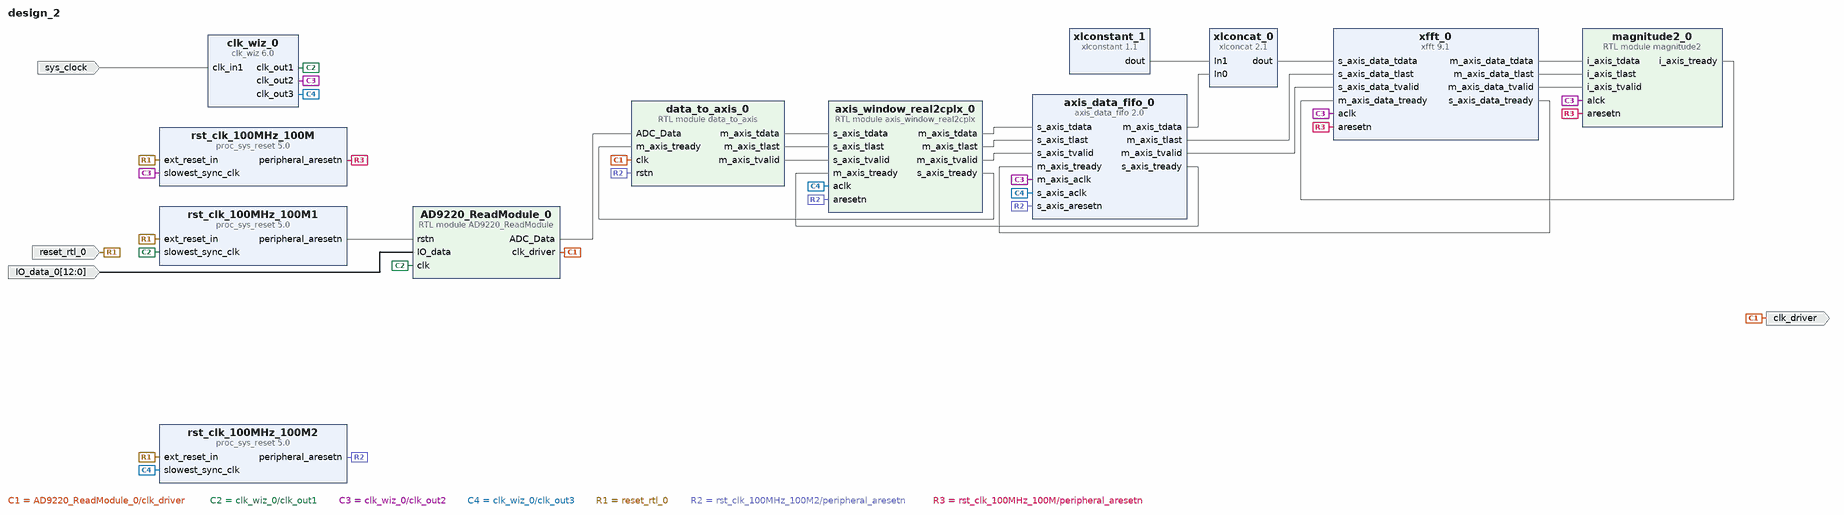
[diagram p0: block diagram of the top level]
# Vivado block design design_2, xc7z020clg400-1, Vivado 2025.2
create_bd_design design_2

create_bd_port -dir I -type rst reset_rtl_0
set_property -dict {CONFIG.POLARITY ACTIVE_HIGH} [get_bd_ports reset_rtl_0]
create_bd_port -dir I -from 12 -to 0 IO_data_0
create_bd_port -dir O -type clk clk_driver
set_property -dict {CONFIG.FREQ_HZ 65000000} [get_bd_ports clk_driver]
create_bd_port -dir I -type clk sys_clock
set_property -dict {CONFIG.FREQ_HZ 125000000} [get_bd_ports sys_clock]

create_bd_cell -type ip -vlnv xilinx.com:ip:proc_sys_reset:5.0 rst_clk_100MHz_100M
create_bd_cell -type module -reference AD9220_ReadModule AD9220_ReadModule_0
create_bd_cell -type module -reference data_to_axis data_to_axis_0
create_bd_cell -type module -reference axis_window_real2cplx axis_window_real2cplx_0
create_bd_cell -type ip -vlnv xilinx.com:ip:xfft:9.1 xfft_0
set_property -dict [list \
  CONFIG.aresetn true \
  CONFIG.input_width 16 \
  CONFIG.number_of_stages_using_block_ram_for_data_and_phase_factors 3 \
  CONFIG.output_ordering natural_order \
  CONFIG.scaling_options scaled \
  CONFIG.target_clock_frequency 100 \
  CONFIG.target_data_throughput 65 \
] [get_bd_cells xfft_0]
create_bd_cell -type ip -vlnv xilinx.com:ip:xlconcat:2.1 xlconcat_0
set_property -dict {CONFIG.IN0_WIDTH 16 CONFIG.IN1_WIDTH 16} [get_bd_cells xlconcat_0]
create_bd_cell -type ip -vlnv xilinx.com:ip:xlconstant:1.1 xlconstant_1
set_property -dict {CONFIG.CONST_VAL 0 CONFIG.CONST_WIDTH 16} [get_bd_cells xlconstant_1]
create_bd_cell -type ip -vlnv xilinx.com:ip:axis_data_fifo:2.0 axis_data_fifo_0
set_property -dict [list \
  CONFIG.FIFO_DEPTH 2048 \
  CONFIG.FIFO_MODE 2 \
  CONFIG.IS_ACLK_ASYNC 1 \
  CONFIG.SYNCHRONIZATION_STAGES 5 \
  CONFIG.TDATA_NUM_BYTES 2 \
] [get_bd_cells axis_data_fifo_0]
create_bd_cell -type ip -vlnv xilinx.com:ip:proc_sys_reset:5.0 rst_clk_100MHz_100M1
create_bd_cell -type ip -vlnv xilinx.com:ip:proc_sys_reset:5.0 rst_clk_100MHz_100M2
create_bd_cell -type ip -vlnv xilinx.com:ip:clk_wiz:6.0 clk_wiz_0
set_property -dict [list \
  CONFIG.CLKIN1_JITTER_PS 80.0 \
  CONFIG.CLKOUT1_DRIVES BUFG \
  CONFIG.CLKOUT1_JITTER 157.214 \
  CONFIG.CLKOUT1_PHASE_ERROR 218.946 \
  CONFIG.CLKOUT1_REQUESTED_OUT_FREQ 130 \
  CONFIG.CLKOUT2_DRIVES BUFG \
  CONFIG.CLKOUT2_JITTER 162.960 \
  CONFIG.CLKOUT2_PHASE_ERROR 218.946 \
  CONFIG.CLKOUT2_REQUESTED_OUT_FREQ 100 \
  CONFIG.CLKOUT2_USED true \
  CONFIG.CLKOUT3_DRIVES BUFG \
  CONFIG.CLKOUT3_JITTER 172.894 \
  CONFIG.CLKOUT3_PHASE_ERROR 218.946 \
  CONFIG.CLKOUT3_REQUESTED_OUT_FREQ 65 \
  CONFIG.CLKOUT3_USED true \
  CONFIG.CLKOUT4_DRIVES BUFG \
  CONFIG.CLKOUT5_DRIVES BUFG \
  CONFIG.CLKOUT6_DRIVES BUFG \
  CONFIG.CLKOUT7_DRIVES BUFG \
  CONFIG.CLK_IN1_BOARD_INTERFACE sys_clock \
  CONFIG.MMCM_BANDWIDTH OPTIMIZED \
  CONFIG.MMCM_CLKFBOUT_MULT_F 52 \
  CONFIG.MMCM_CLKIN1_PERIOD 8.000 \
  CONFIG.MMCM_CLKIN2_PERIOD 10.000 \
  CONFIG.MMCM_CLKOUT0_DIVIDE_F 10 \
  CONFIG.MMCM_CLKOUT1_DIVIDE 13 \
  CONFIG.MMCM_CLKOUT2_DIVIDE 20 \
  CONFIG.MMCM_COMPENSATION ZHOLD \
  CONFIG.MMCM_DIVCLK_DIVIDE 5 \
  CONFIG.NUM_OUT_CLKS 3 \
  CONFIG.PLL_CLKIN_PERIOD 8.000 \
  CONFIG.PRIMITIVE PLL \
  CONFIG.PRIM_IN_FREQ 125.000 \
  CONFIG.PRIM_SOURCE Single_ended_clock_capable_pin \
  CONFIG.USE_LOCKED false \
  CONFIG.USE_RESET false \
] [get_bd_cells clk_wiz_0]
create_bd_cell -type module -reference magnitude2 magnitude2_0

# ---- connections ----

connect_bd_net [get_bd_pins AD9220_ReadModule_0/ADC_Data] [get_bd_pins data_to_axis_0/ADC_Data]
connect_bd_net [get_bd_pins AD9220_ReadModule_0/clk_driver] [get_bd_ports clk_driver] [get_bd_pins data_to_axis_0/clk]
connect_bd_net -net IO_data_0_1 [get_bd_ports IO_data_0] [get_bd_pins AD9220_ReadModule_0/IO_data]
connect_bd_net [get_bd_pins axis_data_fifo_0/m_axis_tdata] [get_bd_pins xlconcat_0/In0]
connect_bd_net [get_bd_pins axis_data_fifo_0/m_axis_tlast] [get_bd_pins xfft_0/s_axis_data_tlast]
connect_bd_net [get_bd_pins axis_data_fifo_0/m_axis_tvalid] [get_bd_pins xfft_0/s_axis_data_tvalid]
connect_bd_net [get_bd_pins axis_data_fifo_0/s_axis_tready] [get_bd_pins axis_window_real2cplx_0/m_axis_tready]
connect_bd_net [get_bd_pins axis_window_real2cplx_0/m_axis_tdata] [get_bd_pins axis_data_fifo_0/s_axis_tdata]
connect_bd_net [get_bd_pins axis_window_real2cplx_0/m_axis_tlast] [get_bd_pins axis_data_fifo_0/s_axis_tlast]
connect_bd_net [get_bd_pins axis_window_real2cplx_0/m_axis_tvalid] [get_bd_pins axis_data_fifo_0/s_axis_tvalid]
connect_bd_net [get_bd_pins axis_window_real2cplx_0/s_axis_tready] [get_bd_pins data_to_axis_0/m_axis_tready]
connect_bd_net [get_bd_pins clk_wiz_0/clk_out1] [get_bd_pins rst_clk_100MHz_100M1/slowest_sync_clk] [get_bd_pins AD9220_ReadModule_0/clk]
connect_bd_net [get_bd_pins clk_wiz_0/clk_out2] \
  [get_bd_pins rst_clk_100MHz_100M/slowest_sync_clk] [get_bd_pins axis_data_fifo_0/m_axis_aclk] [get_bd_pins xfft_0/aclk] \
  [get_bd_pins magnitude2_0/alck]
connect_bd_net -net clk_wiz_1_clk_out1 [get_bd_pins clk_wiz_0/clk_out3] \
  [get_bd_pins rst_clk_100MHz_100M2/slowest_sync_clk] [get_bd_pins axis_data_fifo_0/s_axis_aclk] \
  [get_bd_pins axis_window_real2cplx_0/aclk]
connect_bd_net [get_bd_pins data_to_axis_0/m_axis_tdata] [get_bd_pins axis_window_real2cplx_0/s_axis_tdata]
connect_bd_net [get_bd_pins data_to_axis_0/m_axis_tlast] [get_bd_pins axis_window_real2cplx_0/s_axis_tlast]
connect_bd_net [get_bd_pins data_to_axis_0/m_axis_tvalid] [get_bd_pins axis_window_real2cplx_0/s_axis_tvalid]
connect_bd_net [get_bd_pins magnitude2_0/i_axis_tready] [get_bd_pins xfft_0/m_axis_data_tready]
connect_bd_net -net reset_rtl_0_1 [get_bd_ports reset_rtl_0] \
  [get_bd_pins rst_clk_100MHz_100M/ext_reset_in] [get_bd_pins rst_clk_100MHz_100M1/ext_reset_in] \
  [get_bd_pins rst_clk_100MHz_100M2/ext_reset_in]
connect_bd_net [get_bd_pins rst_clk_100MHz_100M1/peripheral_aresetn] [get_bd_pins AD9220_ReadModule_0/rstn]
connect_bd_net [get_bd_pins rst_clk_100MHz_100M2/peripheral_aresetn] \
  [get_bd_pins axis_data_fifo_0/s_axis_aresetn] [get_bd_pins data_to_axis_0/rstn] \
  [get_bd_pins axis_window_real2cplx_0/aresetn]
connect_bd_net [get_bd_pins rst_clk_100MHz_100M/peripheral_aresetn] [get_bd_pins xfft_0/aresetn] [get_bd_pins magnitude2_0/aresetn]
connect_bd_net -net sys_clk_1 [get_bd_ports sys_clock] [get_bd_pins clk_wiz_0/clk_in1]
connect_bd_net [get_bd_pins xfft_0/m_axis_data_tdata] [get_bd_pins magnitude2_0/i_axis_tdata]
connect_bd_net [get_bd_pins xfft_0/m_axis_data_tlast] [get_bd_pins magnitude2_0/i_axis_tlast]
connect_bd_net [get_bd_pins xfft_0/m_axis_data_tvalid] [get_bd_pins magnitude2_0/i_axis_tvalid]
connect_bd_net [get_bd_pins xfft_0/s_axis_data_tready] [get_bd_pins axis_data_fifo_0/m_axis_tready]
connect_bd_net [get_bd_pins xlconcat_0/dout] [get_bd_pins xfft_0/s_axis_data_tdata]
connect_bd_net [get_bd_pins xlconstant_1/dout] [get_bd_pins xlconcat_0/In1]

validate_bd_design
save_bd_design
